# Altium schematic sheet TinyDVR_Slave.SchDoc
size 292 x 193 mm; Website: wiki-power.com
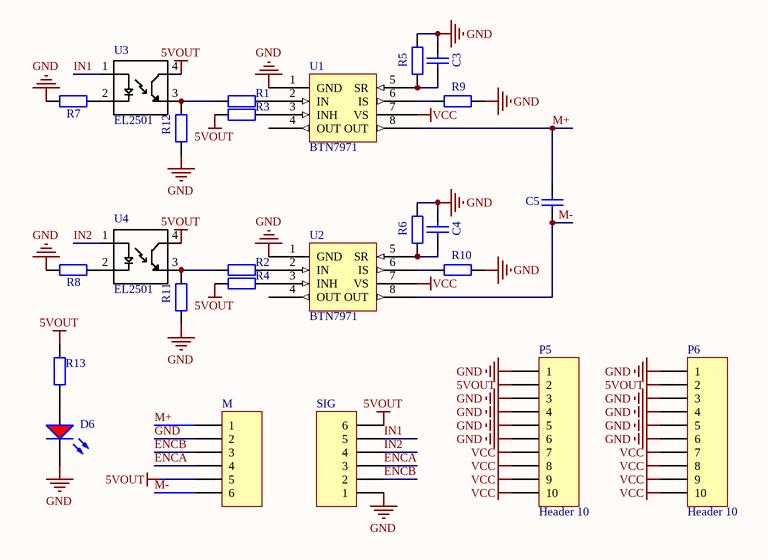
[diagram p0: TinyDVR_Slave.SchDoc]

## Parts
C3  100nF (104) 10% 50V  [0603_C]  (value not drawn)
C4  100nF (104) 10% 50V  [0603_C]  (value not drawn)
C5  22pF (220) 5% 50V  [0603_C]  (value not drawn)
D6  红灯 0603  [0603_LED_S1]  (value not drawn)
M  Header 6H  [HDR1X6H]  (value not drawn)
P5  Header 10  [HDR1X10]
P6  Header 10  [HDR1X10]
R1  10KΩ (1002) ±1%  [0603_R]  (value not drawn)
R2  10KΩ (1002) ±1%  [0603_R]  (value not drawn)
R3  10KΩ (1002) ±1%  [0603_R]  (value not drawn)
R4  10KΩ (1002) ±1%  [0603_R]  (value not drawn)
R5  1KΩ (1001) ±1%  [0603_R]  (value not drawn)
R6  1KΩ (1001) ±1%  [0603_R]  (value not drawn)
R7  1KΩ (1001) ±1%  [0603_R]  (value not drawn)
R8  1KΩ (1001) ±1%  [0603_R]  (value not drawn)
R9  2KΩ (2001) ±1%  [0603_R]  (value not drawn)
R10  2KΩ (2001) ±1%  [0603_R]  (value not drawn)
R11  2KΩ (2001) ±1%  [0603_R]  (value not drawn)
R12  2KΩ (2001) ±1%  [0603_R]  (value not drawn)
R13  4.7k  [0603_R]  (value not drawn)
SIG  Header 6H  [HDR1X6H]  (value not drawn)
U1  BTN7971  [DPAK127P1615X127-8N]
U2  BTN7971  [DPAK127P1615X127-8N]
U3  EL2501  [*SOIC254P1030X390-4N_EL817S1(A)(TU)-V]
U4  EL2501  [*SOIC254P1030X390-4N_EL817S1(A)(TU)-V]

## Nets
5VOUT: M.5 P5.2 P6.2 R3.1 R4.1 R13.2 SIG.6 U3.4(CT) U4.4(CT)
GND: C3.2 C4.2 D6.K M.2 P5.1 P5.3 P5.4 P5.5 P5.6 P6.1 P6.3 P6.4 P6.5 P6.6 R5.2 R6.2 R7.2 R8.2 R9.1 R10.1 R11.1 R12.1 SIG.1 U1.1(GND) U2.1(GND)
VCC: P5.7 P5.8 P5.9 P5.10 P6.7 P6.8 P6.9 P6.10 U1.7(VS) U2.7(VS)
ENCA: M.4 SIG.3
ENCB: M.3 SIG.2
IN1: SIG.5 U3.1(A)
IN2: SIG.4 U4.1(A)
M+: C5.2 M.1 U1.8(OUT)
M-: C5.1 M.6 U2.8(OUT)
NetC3_1: C3.1 R5.1 U1.5(SR)
NetC4_1: C4.1 R6.1 U2.5(SR)
NetD6_A: D6.A R13.1
NetR1_1: R1.1 R12.2 U3.3(ET)
NetR1_2: R1.2 U1.2(IN)
NetR2_1: R2.1 R11.2 U4.3(ET)
NetR2_2: R2.2 U2.2(IN)
NetR3_2: R3.2 U1.3(INH)
NetR4_2: R4.2 U2.3(INH)
NetR7_1: R7.1 U3.2(C)
NetR8_1: R8.1 U4.2(C)
NetR9_2: R9.2 U1.6(IS)
NetR10_2: R10.2 U2.6(IS)

Not connected (* = marked no-connect by the designer): U1 4(OUT); U2 4(OUT)

## Notes on the sheet
- Author
- DocumentName
- ModifiedDate
- ProjectName
- SheetNumber
- SheetTotal
- Website
- Revision

## Library data of the parts
C3 C4 = 0603 100nF (104) 10% 50V: 贴片电容; ComponentLink1Description: 供应商链接; ComponentLink1URL: http://www.szlcsc.com/product/details_15331.html; Package: 0603; Supplier: LC; SuppliersPartNumber: C14663
C5 = 0603 22pF (220) 5% 50V: 贴片电容; ComponentLink1Description: 供应商链接; ComponentLink1URL: http://www.szlcsc.com/product/details_2005.html; Package: 0603; Supplier: LC; SuppliersPartNumber: C1653
D6 = 0603 红灯: 发光二极管; ComponentLink1Description: 供应商链接; ComponentLink1URL: http://www.szlcsc.com/product/details_2659.html; Package: 0603; Supplier: LC; SuppliersPartNumber: C2286
M SIG = Header 6H: Header, 6-Pin, Right Angle; LatestRevisionDate: 17-Jul-2002; LatestRevisionNote: Re-released for DXP Platform.; Publisher: Altium Limited
P5 P6 = Header 10: Header, 10-Pin; LatestRevisionDate: 17-Jul-2002; LatestRevisionNote: Re-released for DXP Platform.; Publisher: Altium Limited
R1-R4 = 0603 10KΩ (1002) 1%: 贴片电阻; ComponentLink1Description: 供应商链接; ComponentLink1URL: http://www.szlcsc.com/product/details_26547.html; Package: 0603; Supplier: LC; SuppliersPartNumber: C25804
R5-R8 = 0603 1KΩ (1001) 1%: 贴片电阻; ComponentLink1Description: 供应商链接; ComponentLink1URL: http://www.szlcsc.com/product/details_21904.html; Package: 0603; Supplier: LC; SuppliersPartNumber: C21190
R9-R12 = 0603 2KΩ (2001) 1%: 贴片电阻; ComponentLink1Description: 供应商链接; ComponentLink1URL: http://www.szlcsc.com/product/details_23702.html; Package: 0603; Supplier: LC; SuppliersPartNumber: C22975
R13 = 0603 470Ω (4700) 1%: 贴片电阻; ComponentLink1Description: 供应商链接; ComponentLink1URL: http://www.szlcsc.com/product/details_23906.html; Package: 0603; Supplier: LC; SuppliersPartNumber: C23179
U3 U4 = EL817S1(A)(TU)-V: Optoisoltr 5kv Transistor 4-Smd; MF: Everlight Electronics; MP: EL817S1_A__TU_-V; Package: SMD-4 Everlight Electronics; Price: None; Availability: Unavailable; SnapEDA_Link: https://www.snapeda.com/parts/EL817S1%28A%29%28TU%29-V/Everlight%20Electronics%20Co%20Ltd/view-part/?ref=snap; Value: *